# Altium schematic sheet schematic7.SchDoc
size A
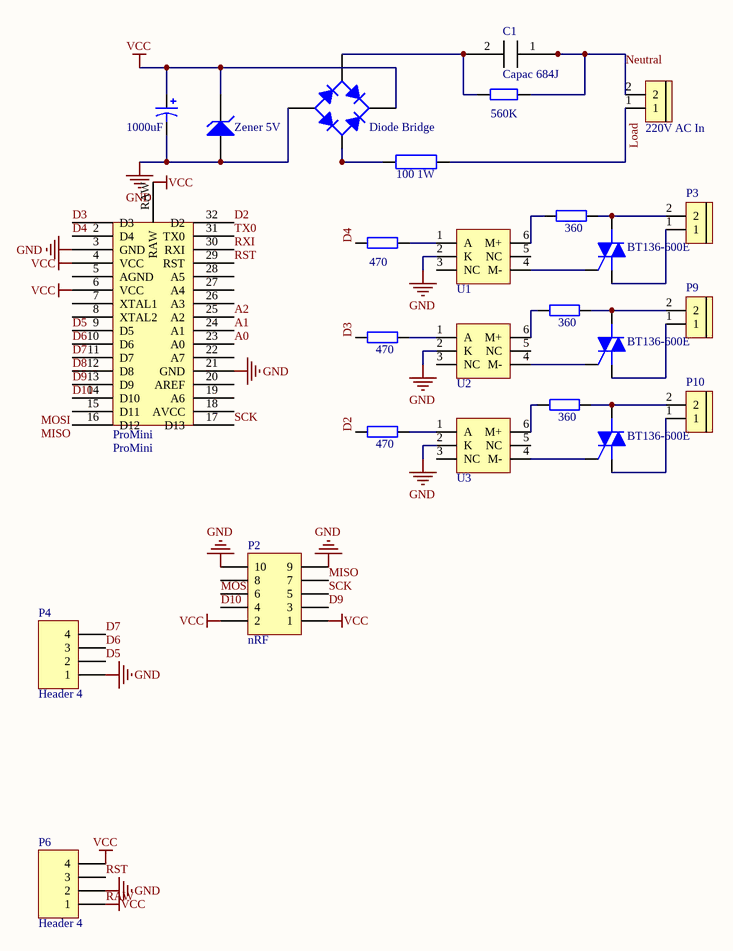
[diagram p0: schematic7.SchDoc]

## Parts
C1  Capac 684J  [Tu keo 684J 400V]
C3  1000uF  [C10mm]
D1  Diode Bridge  [D-38]
D3  Zener 5V  [DIODE/NOM/0.5A]
P1  220V AC In  [BIG_Header 2]
P2  nRF  [HDR2X5]
P3  BIG_Header 2  [BIG_Header 2]  (value not drawn)
P4  Header 4  [HDR1X4]
P6  Header 4  [HDR1X4]
P9  BIG_Header 2  [BIG_Header 2]  (value not drawn)
P10  BIG_Header 2  [BIG_Header 2]  (value not drawn)
ProMini  ProMini  [Arduino Pro Mini]
Q1  BT136-600E  [BTA6-600]
Q2  BT136-600E  [BTA6-600]
Q3  BT136-600E  [BTA6-600]
R1  100 1W  [DIEN TRO 1W (tube)]
R3  560K  [AXIAL-0.4]
R4  470  [R1/4W]
R5  360  [R1/4W]
R7  470  [R1/4W]
R8  360  [R1/4W]
R9  470  [R1/4W]
R10  360  [R1/4W]
U1  MOC3021M  [MOC30XX]  (value not drawn)
U2  MOC3021M  [MOC30XX]  (value not drawn)
U3  MOC3021M  [MOC30XX]  (value not drawn)

## Nets
GND: C3.2 D1.3(A) D3.1(A) P2.9 P2.10 P4.1 P6.2 ProMini.3(GND) ProMini.21(GND) U1.2(K) U2.2(K) U3.2(K)
RAW: C3.1 D1.1(K) D3.2(K) P2.1 P2.2 P6.1 P6.4 ProMini.4(VCC) ProMini.6(VCC) ProMini.RAW  [also labelled VCC]
A0: ProMini.23(A0)
A1: ProMini.24(A1)
A2: ProMini.25(A2)
D2: ProMini.32(D2) R9.1
D3: ProMini.1(D3) R7.1
D4: ProMini.2(D4) R4.1
D5: P4.2 ProMini.9(D5)
D6: P4.3 ProMini.10(D6)
D7: P4.4 ProMini.11(D7)
D8: ProMini.12(D8)
D9: P2.3 ProMini.13(D9)
D10: P2.4 ProMini.14(D10)
Load: P1.1 R1.2
MISO: P2.7 ProMini.16(D12)
MOSI: P2.6 ProMini.15(D11)
Neutral: C1.1 P1.2 R3.2
RST: P6.3 ProMini.29(RST)
RXI: ProMini.30(RXI)
SCK: P2.5 ProMini.17(D13)
TX0: ProMini.31(TX0)
NetC1_2: C1.2 D1.4(C) R3.1
NetD1_2: D1.2(C) R1.1
NetP3_1: P3.1 Q1.1(M1)
NetP3_2: P3.2 Q1.2(M2) R5.2
NetP9_1: P9.1 Q2.1(M1)
NetP9_2: P9.2 Q2.2(M2) R8.2
NetP10_1: P10.1 Q3.1(M1)
NetP10_2: P10.2 Q3.2(M2) R10.2
NetQ1_3: Q1.3(G) U1.4(M-)
NetQ2_3: Q2.3(G) U2.4(M-)
NetQ3_3: Q3.3(G) U3.4(M-)
NetR4_2: R4.2 U1.1(A)
NetR5_1: R5.1 U1.6(M+)
NetR7_2: R7.2 U2.1(A)
NetR8_1: R8.1 U2.6(M+)
NetR9_2: R9.2 U3.1(A)
NetR10_1: R10.1 U3.6(M+)

Not connected (* = marked no-connect by the designer): P2 8; ProMini 5(AGND) 7(XTAL1) 8(XTAL2) 18(AVCC) 19(A6) 20(AREF) 22(A7) 26(A3) 27(A4) 28(A5); U1 3(NC) 5(NC); U2 3(NC) 5(NC); U3 3(NC) 5(NC)

## Library data of the parts
C1 = Tu keo 684J 400V
C3 = Cap Pol 8mm: Polarized Capacitor (Axial); Published: 8-Jun-2000; LatestRevisionDate: 17-Jul-2002; LatestRevisionNote: Re-released for DXP Platform.; PackageReference: POLAR0.8; Publisher: Altium Limited; Value: 1000uF
D1 = Bridge1: Full Wave Diode Bridge; Published: 8-Jun-2000; LatestRevisionDate: 29-May-2009; LatestRevisionNote: Sch pins A & K swapped.; DatasheetVersion: E2732B; PackageReference: D-38; Publisher: Altium Limited; PackageDescription: Bridge Rectifier; 4 Terminals; Body 9.4 x 9.4 mm (typ); Pitch 5.08 mm
D3 = Diode Zener: Zener Diode; Voltage: 5; Published: 8-Jun-2000; LatestRevisionDate: 17-Jul-2002; LatestRevisionNote: Re-released for DXP Platform.; PackageReference: DIODE-0.7; Publisher: Altium Limited
P1 = BIG_Header 2
P2 = Header 5X2: Header, 5-Pin, Dual row; LatestRevisionDate: 17-Jul-2002; LatestRevisionNote: Re-released for DXP Platform.; Publisher: Altium Limited
P4 P6 = Header 4: Header, 4-Pin; LatestRevisionDate: 17-Jul-2002; LatestRevisionNote: Re-released for DXP Platform.; Publisher: Altium Limited
ProMini = Pro Mini
Q1-Q3 = BTA12-600: Silicon Bidirectional Triode Thyristor; Note: Pin 2 is electrically connected to Pin 4 (TAB); Published: 29-Sep-2000; LatestRevisionDate: 17-Jul-2002; LatestRevisionNote: Re-released for DXP Platform.; DatasheetDocument: 1999; PackageReference: 369-03; Publisher: Altium Limited; Code_JEDEC: TO-251-AA; ComponentLink1Description: Manufacturer Link; ComponentLink1URL: http://www.motorola.com/
R1 = Res 1W: 1W Res Power; Value: 100; Voltage: 400; Creator: Nguyen Ba Bien
R3 = Res2: Resistor; Published: 8-Jun-2000; LatestRevisionDate: 17-Jul-2002; LatestRevisionNote: Re-released for DXP Platform.; PackageReference: AXIAL-0.4; Publisher: Altium Limited; PackageDescription: Axial Device, Thru-Hole; 2 Leads; 0.4 in Pin Spacing; Value: 560K
R4 R5 R7-R10 = R1/4W: Resistor
  R4 R7 R9: Value: 470
  R5 R8 R10: Value: 360